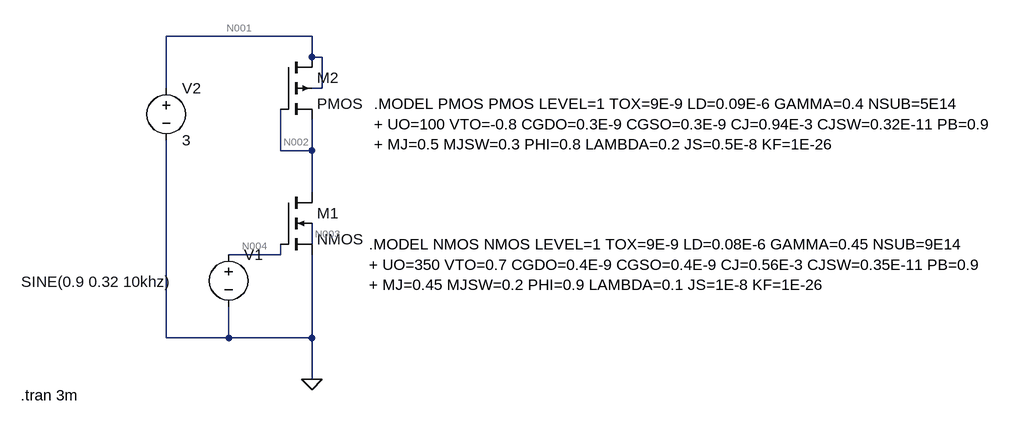
[diagram p0: schematic hw2.asc]
hw2.asc, the LTspice schematic file:
Version 4
SHEET 1 1392 680
WIRE 288 -64 64 -64
WIRE 288 -32 288 -64
WIRE 304 -32 288 -32
WIRE 64 16 64 -64
WIRE 304 16 304 -32
WIRE 304 16 288 16
WIRE 240 112 240 48
WIRE 288 112 288 64
WIRE 288 112 240 112
WIRE 288 176 288 112
WIRE 288 256 288 224
WIRE 240 272 240 256
WIRE 240 272 160 272
WIRE 64 400 64 96
WIRE 160 400 160 352
WIRE 160 400 64 400
WIRE 288 400 288 272
WIRE 288 400 160 400
WIRE 288 464 288 400
FLAG 288 464 0
SYMBOL nmos4 240 176 R0
SYMATTR InstName M1
SYMATTR Value2 l=2um w=8um ad=40p as=40p
SYMBOL pmos4 240 -32 R0
SYMATTR InstName M2
SYMATTR Value2 l=2um w=7um ad=35p as=35p
SYMBOL voltage 160 256 R0
WINDOW 3 -319 58 Left 2
WINDOW 123 0 0 Left 0
WINDOW 39 0 0 Left 0
SYMATTR Value SINE(0.9 0.32 10khz)
SYMATTR InstName V1
SYMBOL voltage 64 0 R0
WINDOW 123 0 0 Left 0
WINDOW 39 0 0 Left 0
SYMATTR InstName V2
SYMATTR Value 3
TEXT 376 256 Left 2 !.MODEL NMOS NMOS LEVEL=1 TOX=9E-9 LD=0.08E-6 GAMMA=0.45 NSUB=9E14\n+ UO=350 VTO=0.7 CGDO=0.4E-9 CGSO=0.4E-9 CJ=0.56E-3 CJSW=0.35E-11 PB=0.9\n+ MJ=0.45 MJSW=0.2 PHI=0.9 LAMBDA=0.1 JS=1E-8 KF=1E-26
TEXT 384 40 Left 2 !.MODEL PMOS PMOS LEVEL=1 TOX=9E-9 LD=0.09E-6 GAMMA=0.4 NSUB=5E14\n+ UO=100 VTO=-0.8 CGDO=0.3E-9 CGSO=0.3E-9 CJ=0.94E-3 CJSW=0.32E-11 PB=0.9\n+ MJ=0.5 MJSW=0.3 PHI=0.8 LAMBDA=0.2 JS=0.5E-8 KF=1E-26
TEXT -160 488 Left 2 !.tran 3m

The netlist it stands for:
* hw2.asc
M1 N002 N004 0 N003 NMOS l=2um w=8um ad=40p as=40p
M2 N001 N002 N002 N001 PMOS l=2um w=7um ad=35p as=35p
V1 N004 0 SINE(0.9 0.32 10khz)
V2 N001 0 3
.model NMOS NMOS
.model PMOS PMOS
.lib standard.mos
.MODEL NMOS NMOS LEVEL=1 TOX=9E-9 LD=0.08E-6 GAMMA=0.45 NSUB=9E14
+ UO=350 VTO=0.7 CGDO=0.4E-9 CGSO=0.4E-9 CJ=0.56E-3 CJSW=0.35E-11 PB=0.9
+ MJ=0.45 MJSW=0.2 PHI=0.9 LAMBDA=0.1 JS=1E-8 KF=1E-26
.MODEL PMOS PMOS LEVEL=1 TOX=9E-9 LD=0.09E-6 GAMMA=0.4 NSUB=5E14
+ UO=100 VTO=-0.8 CGDO=0.3E-9 CGSO=0.3E-9 CJ=0.94E-3 CJSW=0.32E-11 PB=0.9
+ MJ=0.5 MJSW=0.3 PHI=0.8 LAMBDA=0.2 JS=0.5E-8 KF=1E-26
.tran 3m
.backanno
.end

* Results of the author's LTspice run, read from the files saved beside the schematic
* Operating Point, zero values left out:
*   V(n002) = 1.653 V
*   V(n004) = 900 mV
*   V(n003) = 365.9 mV
*   V(n001) = 3 V
*   Id(M2) = 27.98 µA
*   Ib(M2) = 1.347 pA
*   Is(M2) = -27.98 µA
*   Id(M1) = 27.98 µA
*   Is(M1) = -27.98 µA
*   I(V2) = -27.98 µA
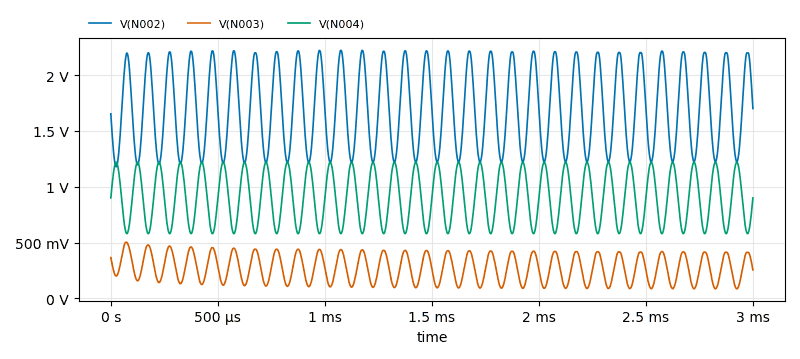
[diagram p1: Transient Analysis of hw2.asc, plotted from the saved traces]
* Transient Analysis, 1 run:
*   V(N002): min 1.179 V, max 2.222 V, average 1.707 V, rms 1.743 V, last 1.701 V
*   V(N003): min 86.15 mV, max 504.1 mV, average 272 mV, rms 297 mV, last 254.9 mV
*   V(N004): min 580 mV, max 1.22 V, average 900 mV, rms 928 mV, last 900 mV